# EAGLE design piZero_node (EAGLE 7.6.0)
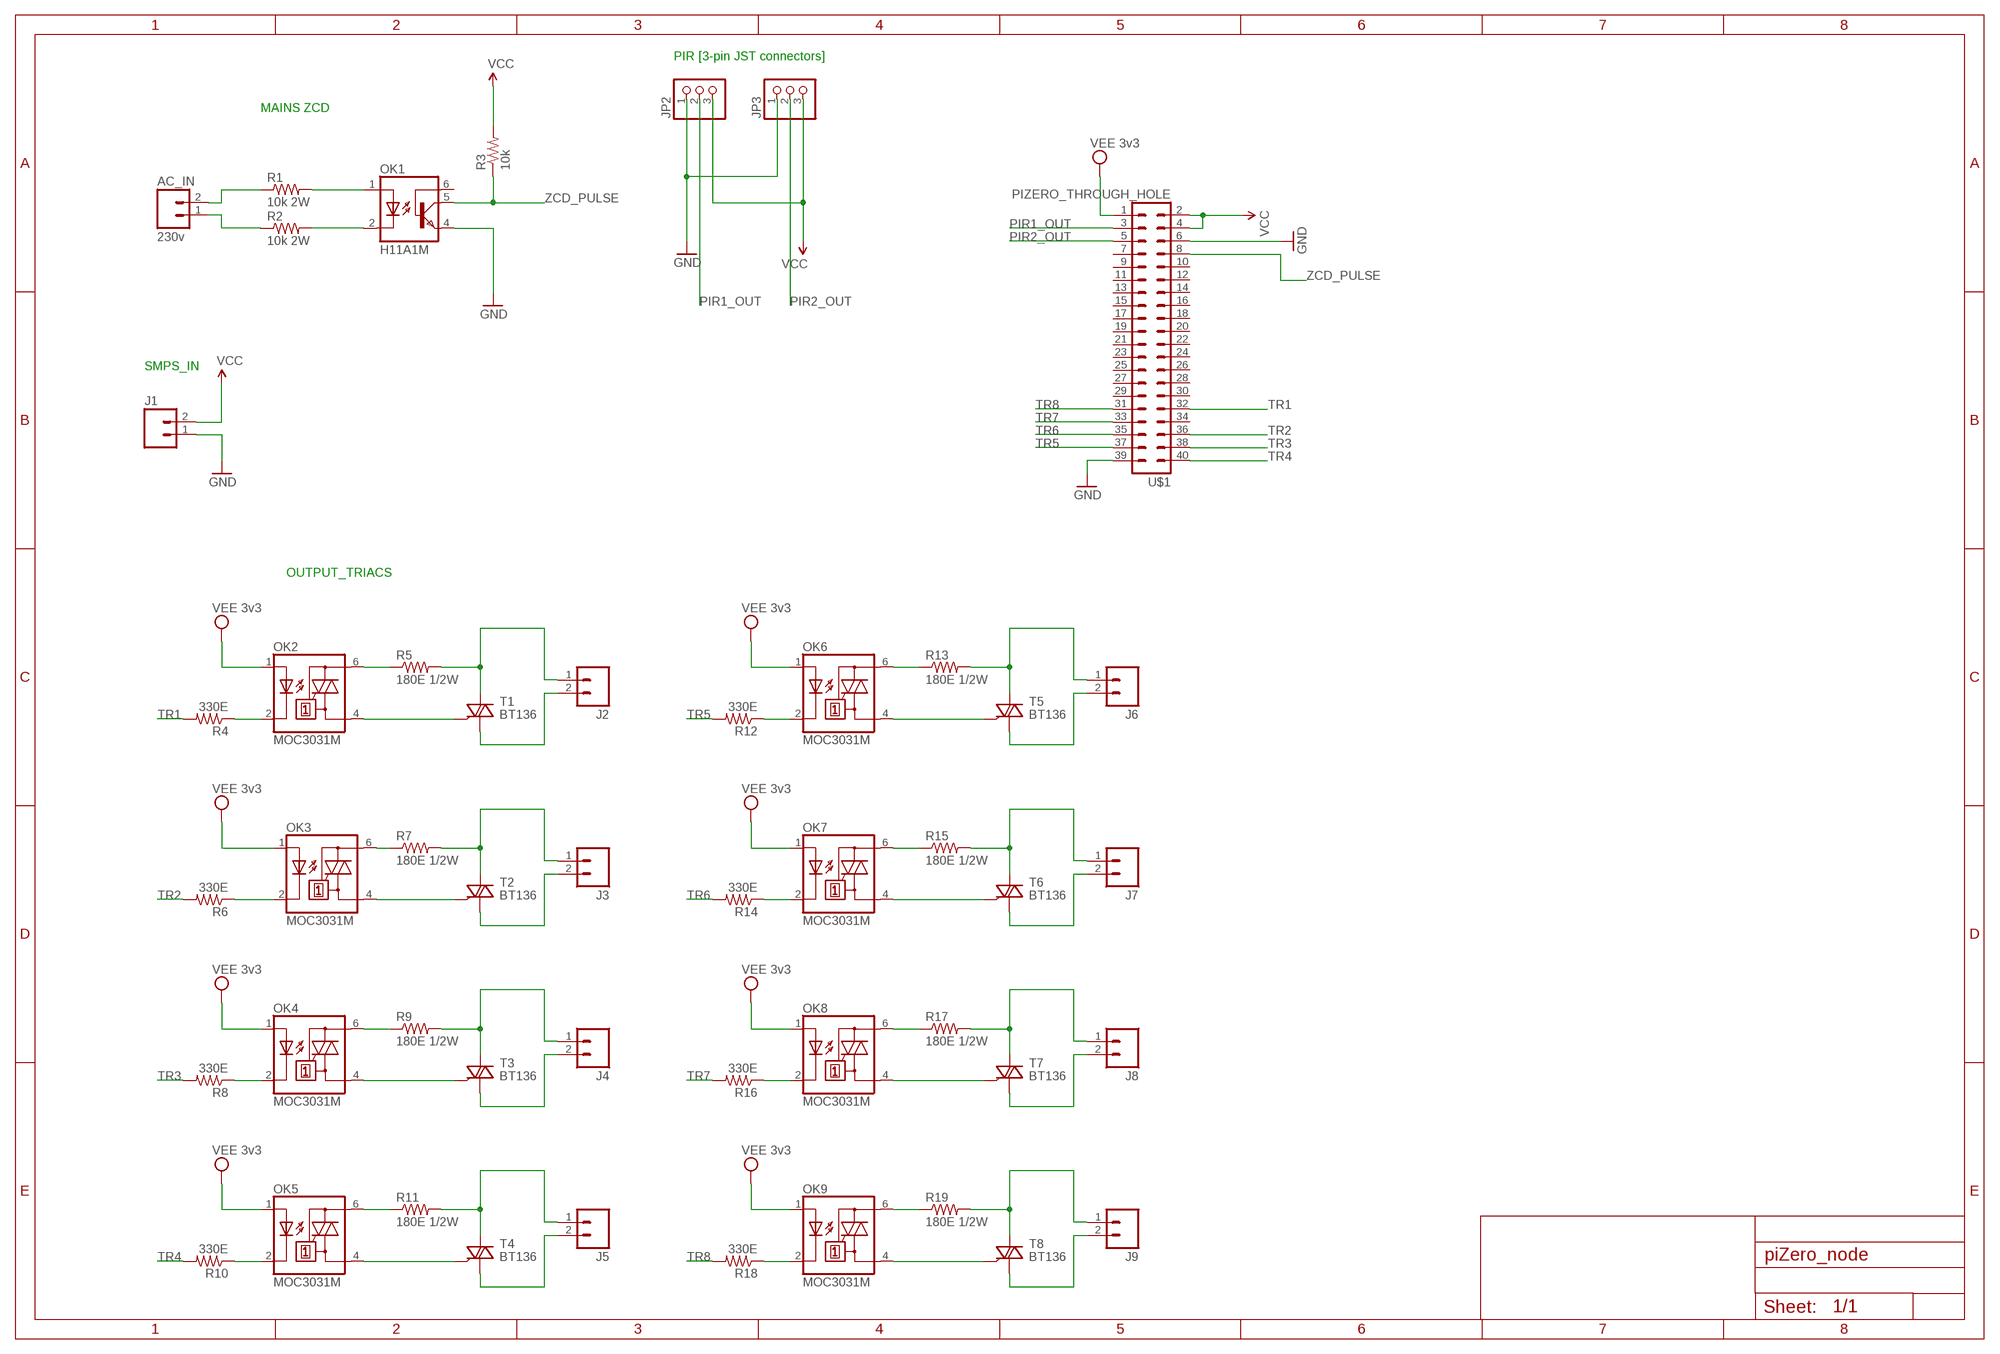
[diagram p0: schematic, sheet 1]

## Parts
AC_IN  230v  M023.5MM_LOCK  [SCREWTERMINAL-3.5MM-2_LOCK]
J1  M023.5MM_LOCK  [SCREWTERMINAL-3.5MM-2_LOCK]
J2  M023.5MM_LOCK  [SCREWTERMINAL-3.5MM-2_LOCK]
J3  M023.5MM_LOCK  [SCREWTERMINAL-3.5MM-2_LOCK]
J4  M023.5MM_LOCK  [SCREWTERMINAL-3.5MM-2_LOCK]
J5  M023.5MM_LOCK  [SCREWTERMINAL-3.5MM-2_LOCK]
J6  M023.5MM_LOCK  [SCREWTERMINAL-3.5MM-2_LOCK]
J7  M023.5MM_LOCK  [SCREWTERMINAL-3.5MM-2_LOCK]
J8  M023.5MM_LOCK  [SCREWTERMINAL-3.5MM-2_LOCK]
J9  M023.5MM_LOCK  [SCREWTERMINAL-3.5MM-2_LOCK]
JP2  PINHD-1X3  [1X03]
JP3  PINHD-1X3  [1X03]
OK1  H11A1M  [DIL06]
OK2  MOC3031M  [DIL06]
OK3  MOC3031M  [DIL06]
OK4  MOC3031M  [DIL06]
OK5  MOC3031M  [DIL06]
OK6  MOC3031M  [DIL06]
OK7  MOC3031M  [DIL06]
OK8  MOC3031M  [DIL06]
OK9  MOC3031M  [DIL06]
R1  10k 2W  RESISTORPTH-2W  [AXIAL-0.8]
R2  10k 2W  RESISTORPTH-2W  [AXIAL-0.8]
R3  10k  RESISTORPTH-1/4W  [AXIAL-0.4]
R4  330E  RESISTORPTH-1/4W  [AXIAL-0.4]
R5  180E 1/2W  RESISTORPTH-1/2W  [AXIAL-0.5]
R6  330E  RESISTORPTH-1/4W  [AXIAL-0.4]
R7  180E 1/2W  RESISTORPTH-1/2W  [AXIAL-0.5]
R8  330E  RESISTORPTH-1/4W  [AXIAL-0.4]
R9  180E 1/2W  RESISTORPTH-1/2W  [AXIAL-0.5]
R10  330E  RESISTORPTH-1/4W  [AXIAL-0.4]
R11  180E 1/2W  RESISTORPTH-1/2W  [AXIAL-0.5]
R12  330E  RESISTORPTH-1/4W  [AXIAL-0.4]
R13  180E 1/2W  RESISTORPTH-1/2W  [AXIAL-0.5]
R14  330E  RESISTORPTH-1/4W  [AXIAL-0.4]
R15  180E 1/2W  RESISTORPTH-1/2W  [AXIAL-0.5]
R16  330E  RESISTORPTH-1/4W  [AXIAL-0.4]
R17  180E 1/2W  RESISTORPTH-1/2W  [AXIAL-0.5]
R18  330E  RESISTORPTH-1/4W  [AXIAL-0.4]
R19  180E 1/2W  RESISTORPTH-1/2W  [AXIAL-0.5]
T1  BT136  [TO220AB]
T2  BT136  [TO220AB]
T3  BT136  [TO220AB]
T4  BT136  [TO220AB]
T5  BT136  [TO220AB]
T6  BT136  [TO220AB]
T7  BT136  [TO220AB]
T8  BT136  [TO220AB]
U$1  PIZERO_THROUGH_HOLE  [PIZERO_THOUGH_HOLE]

## Nets
GND: J1.1 JP2.1 JP3.1 OK1.4(EMI) U$1.6 U$1.39
N$1: AC_IN.2 R1.P$1
N$2: AC_IN.1 R2.P$1
N$3: OK1.1(A) R1.P$2
N$4: OK1.2(C) R2.P$2
N$5: OK3.6(A2) R7.P$1
N$6: OK2.6(A2) R5.P$1
N$7: J2.1 R5.P$2 T1.2(A2)
N$8: OK2.4(A1) T1.3(G)
N$9: J2.2 T1.1(A1)
N$10: OK2.2(C) R4.P$1
N$11: J3.1 R7.P$2 T2.2(A2)
N$12: OK3.4(A1) T2.3(G)
N$13: J3.2 T2.1(A1)
N$14: OK3.2(C) R6.P$1
N$15: OK4.6(A2) R9.P$1
N$16: J4.1 R9.P$2 T3.2(A2)
N$17: OK4.4(A1) T3.3(G)
N$18: J4.2 T3.1(A1)
N$19: OK4.2(C) R8.P$1
N$20: OK5.6(A2) R11.P$1
N$21: J5.1 R11.P$2 T4.2(A2)
N$22: OK5.4(A1) T4.3(G)
N$23: J5.2 T4.1(A1)
N$24: OK5.2(C) R10.P$1
N$25: OK6.6(A2) R13.P$1
N$26: J6.1 R13.P$2 T5.2(A2)
N$27: OK6.4(A1) T5.3(G)
N$28: J6.2 T5.1(A1)
N$29: OK6.2(C) R12.P$1
N$30: OK7.6(A2) R15.P$1
N$31: J7.1 R15.P$2 T6.2(A2)
N$32: OK7.4(A1) T6.3(G)
N$33: J7.2 T6.1(A1)
N$34: OK7.2(C) R14.P$1
N$35: OK8.6(A2) R17.P$1
N$36: J8.1 R17.P$2 T7.2(A2)
N$37: OK8.4(A1) T7.3(G)
N$38: J8.2 T7.1(A1)
N$39: OK8.2(C) R16.P$1
N$40: OK9.6(A2) R19.P$1
N$41: J9.1 R19.P$2 T8.2(A2)
N$42: OK9.4(A1) T8.3(G)
N$43: J9.2 T8.1(A1)
N$44: OK9.2(C) R18.P$1
PIR1_OUT: JP2.2 U$1.3
PIR2_OUT: JP3.2 U$1.5
TR1: R4.P$2 U$1.32
TR2: R6.P$2 U$1.36
TR3: R8.P$2 U$1.38
TR4: R10.P$2 U$1.40
TR5: R12.P$2 U$1.37
TR6: R14.P$2 U$1.35
TR7: R16.P$2 U$1.33
TR8: R18.P$2 U$1.31
VCC: J1.2 JP2.3 JP3.3 R3.P$2 U$1.2 U$1.4
VEE: OK2.1(A) OK3.1(A) OK4.1(A) OK5.1(A) OK6.1(A) OK7.1(A) OK8.1(A) OK9.1(A) U$1.1 ; supply symbol labelled VEE 3v3
ZCD_PULSE: OK1.5(COL) R3.P$1 U$1.8
Unconnected: OK1.6(BAS) U$1.7 U$1.9 U$1.10 U$1.11 U$1.12 U$1.13 U$1.14 U$1.15 U$1.16 U$1.17 U$1.18 U$1.19 U$1.20 U$1.21 U$1.22 U$1.23 U$1.24 U$1.25 U$1.26 U$1.27 U$1.28 U$1.29 U$1.30 U$1.34

## Notes on the sheet
- PIR [3-pin JST connectors]
- MAINS ZCD
- SMPS_IN
- OUTPUT_TRIACS

## Library data of the parts
AC_IN J1-J9 = SparkFun-Connectors:M02: Standard 2-pin 0.1" header. Use with - straight break away headers ( PRT-00116) - right angle break away headers (PRT-00553) - swiss pins (PRT-00743) - machine pins (PRT-00117) - female headers (PRT-00115) Molex polarized connector foot print use with: PRT-08233 with associated crimp pins and housings. 2.54_SCREWTERM for use with PRT-10571. 3.5mm Screw Terminal footprints for PRT-08084 5mm Screw Terminal footprints for use with PRT-08432; PROD_ID: CONN-08399
JP2 JP3 = pinhead:PINHD-1X3: PIN HEADER
OK1 = optocoupler:H11A*?M: General Purpose 6-Pin Phototransistor Optocouplers Source: http://www.fairchildsemi.com/ds/4N/4N35-M.pdf; MPN: H11A1-M; OC_FARNELL: 1021358; OC_NEWARK: 97K1793
OK2-OK9 = optocoupler:MOC30*: 6-Pin DIP Zero-Cross Optoisolators Triac Driver Output (250/400 Volt Peak) Source: Data sheet <http://www.fairchildsemi.com/ds/MO/MOC3031M.pdf> The old path of data sheet not more available 2013-05-06.; MF: FAIRCHILD SEMICONDUCTOR; MPN: MOC3031M; OC_FARNELL: 9875964; OC_NEWARK: 78K6089
R1-R19 = SparkFun-Passives:RESISTOR: Resistor Basic schematic elements and footprints for 0603, 1206, and PTH resistors.
T1-T8 = triac:BT136: Triac BT136 series E sensitive gate Source: http://www.nxp.com/acrobat_download/datasheets/BT136_SERIES_E_2.pdf
U$1 = pizero:PIZERO_THROUGH_HOLE

## Board
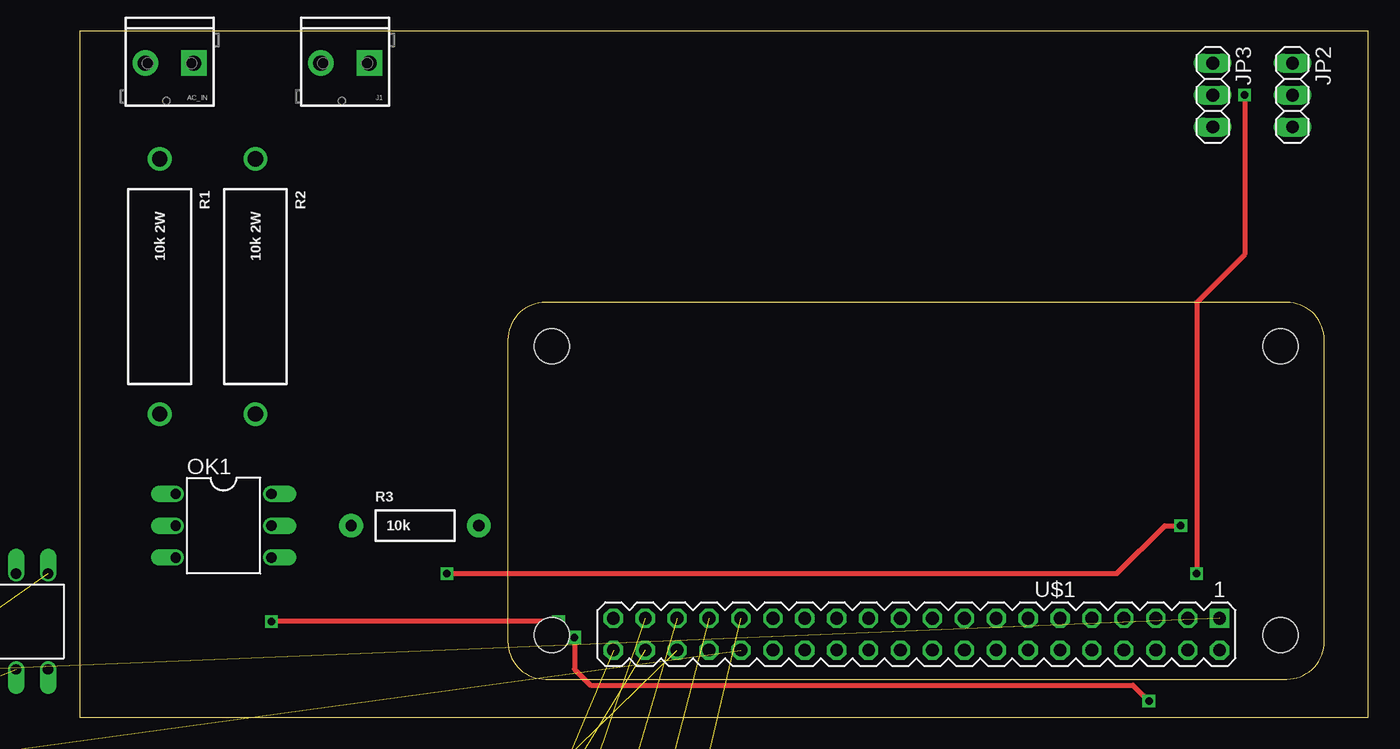
[diagram p1: board, top side]
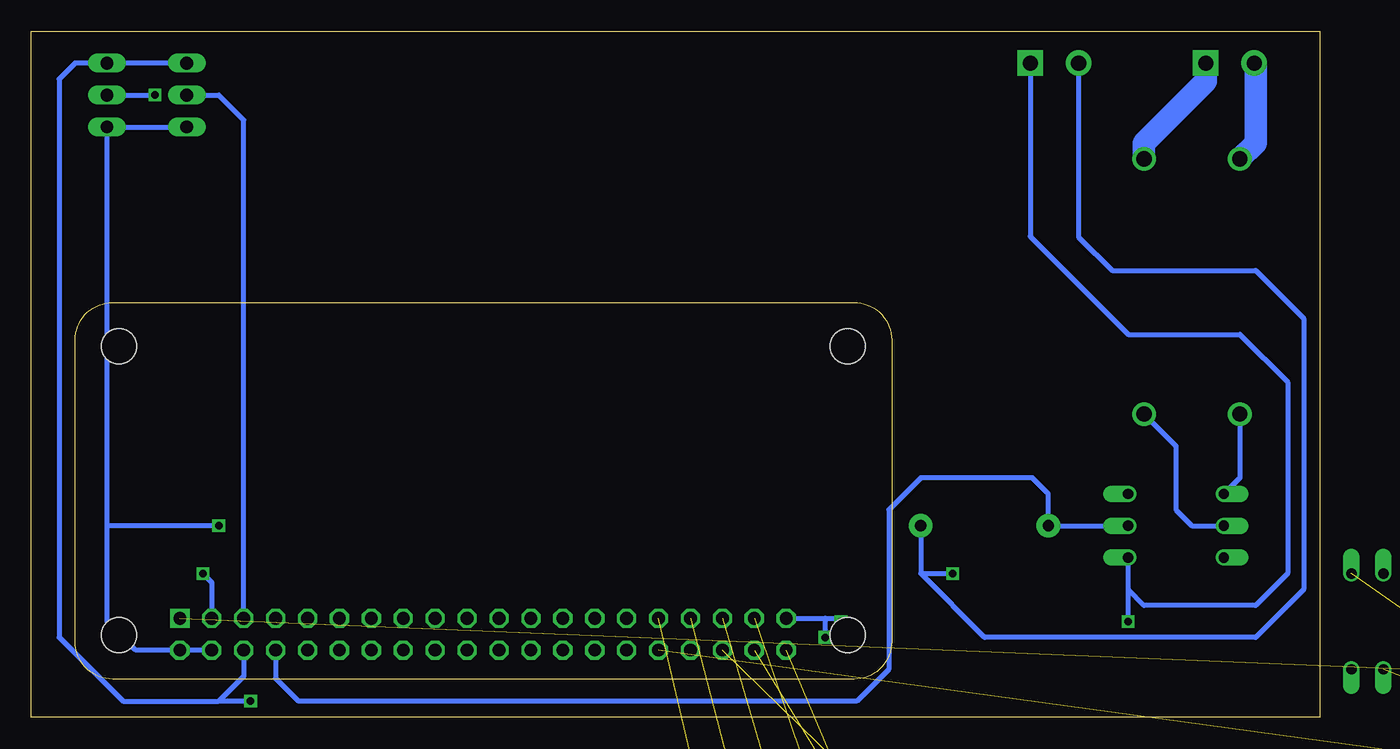
[diagram p2: board, bottom side, seen from below]

Size 102.54 x 54.6 mm. Coordinates in mm from the lower left corner, seen from the top.
Outline: 0,0 102.54,0 102.54,54.6 0,54.6 0,0
Copper layers (1*16): Top 0.035mm / dielectric 1.5mm / Bottom 0.035mm
Design rules "default": minimum track width 10mil, minimum drill 24mil, track to track 8mil, track to pad 8mil, pad to pad 8mil, via to via 8mil, smd to smd 8mil, copper to edge 40mil, drill to drill 8mil, minimum pad ring 10mil, minimum via ring 8mil, stop-mask expansion 4mil, vias tented up to drill 0mil, thermal gap 10mil

### Footprints (pad centres in the part's own frame; a part is rotated, then mirrored left to right if it is on the bottom)
SCREWTERMINAL-3.5MM-2_LOCK = drill 1.2 pad 2.032 square: 1 -0.178,0 | drill 1.2 pad 2.032: 2 3.678,0
1X03 = drill 1.016 long: 1 -2.54,0; 2 0,0; 3 2.54,0
DIL06 = drill 0.813 offset: 1 -2.54,-3.81; 2 0,-3.81; 3 2.54,-3.81; 4 2.54,3.81; 5 0,3.81; 6 -2.54,3.81
AXIAL-0.8 = drill 1.2 pad 1.88: P$1 -10.16,0; P$2 10.16,0
AXIAL-0.4 = drill 0.9 pad 1.88: P$1 -5.08,0; P$2 5.08,0
AXIAL-0.5 = drill 0.9 pad 1.88: P$1 -6.35,0; P$2 6.35,0
TO220AB = drill 1.118 long: 1 -2.54,-6.35; 2 0,-6.35; 3 2.54,-6.35 | hole 3.302: 0,11.176
PIZERO_THOUGH_HOLE = drill 1.016 square: 1 8.34,25.15 | drill 1.016 octagon: 2 8.34,27.69; 3 10.88,25.15; 4 10.88,27.69; 5 13.42,25.15; 6 13.42,27.69; 7 15.96,25.15; 8 15.96,27.69; 9 18.5,25.15; 10 18.5,27.69; 11 21.04,25.15; 12 21.04,27.69; 13 23.58,25.15; 14 23.58,27.69; 15 26.12,25.15; 16 26.12,27.69; 17 28.66,25.15; 18 28.66,27.69; 19 31.2,25.15; 20 31.2,27.69; 21 33.74,25.15; 22 33.74,27.69; 23 36.28,25.15; 24 36.28,27.69; 25 38.82,25.15; 26 38.82,27.69; 27 41.36,25.15; 28 41.36,27.69; 29 43.9,25.15; 30 43.9,27.69; 31 46.44,25.15; 32 46.44,27.69; 33 48.98,25.15; 34 48.98,27.69; 35 51.52,25.15; 36 51.52,27.69; 37 54.06,25.15; 38 54.06,27.69; 39 56.6,25.15; 40 56.6,27.69 | hole 2.8: 3.5,3.5; 3.5,26.5; 61.5,26.5; 61.5,3.5

### Placement (x,y rotation side)
AC_IN  8.89,52.07 180 top
J1  22.86,52.07 180 top
J2  -22.86,-15.24 0 top  (outside the outline)
J3  -22.86,-46.99 0 top  (outside the outline)
J4  -22.86,-83.82 0 top  (outside the outline)
J5  -22.86,-120.65 0 top  (outside the outline)
J6  -22.86,-157.48 0 top  (outside the outline)
J7  -22.86,-194.31 0 top  (outside the outline)
J8  -22.86,-231.14 0 top  (outside the outline)
J9  -22.86,-267.97 0 top  (outside the outline)
JP2  96.52,49.53 270 top
JP3  90.17,49.53 270 top
OK1  11.43,15.24 270 top
OK2  -5.08,7.62 0 top
OK3  -6.35,-26.67 0 top  (outside the outline)
OK4  -6.35,-63.5 0 top  (outside the outline)
OK5  -6.35,-100.33 0 top  (outside the outline)
OK6  -6.35,-137.16 0 top  (outside the outline)
OK7  -6.35,-173.99 0 top  (outside the outline)
OK8  -6.35,-210.82 0 top  (outside the outline)
OK9  -6.35,-247.65 0 top  (outside the outline)
R1  6.35,34.29 270 top
R2  13.97,34.29 270 top
R3  26.67,15.24 0 top
R4  -19.05,-3.81 0 top  (outside the outline)
R5  -17.78,-8.89 0 top  (outside the outline)
R6  -19.05,-54.61 0 top  (outside the outline)
R7  -8.89,-46.99 0 top  (outside the outline)
R8  -19.05,-91.44 0 top  (outside the outline)
R9  -8.89,-83.82 0 top  (outside the outline)
R10  -19.05,-128.27 0 top  (outside the outline)
R11  -8.89,-120.65 0 top  (outside the outline)
R12  -19.05,-165.1 0 top  (outside the outline)
R13  -8.89,-157.48 0 top  (outside the outline)
R14  -19.05,-201.93 0 top  (outside the outline)
R15  -8.89,-194.31 0 top  (outside the outline)
R16  -19.05,-238.76 0 top  (outside the outline)
R17  -8.89,-231.14 0 top  (outside the outline)
R18  -19.05,-275.59 0 top  (outside the outline)
R19  -8.89,-267.97 0 top  (outside the outline)
T1  -17.78,8.89 0 top  (outside the outline)
T2  -17.78,-34.29 0 top  (outside the outline)
T3  -17.78,-71.12 0 top  (outside the outline)
T4  -17.78,-107.95 0 top  (outside the outline)
T5  -17.78,-144.78 0 top  (outside the outline)
T6  -17.78,-181.61 0 top  (outside the outline)
T7  -17.78,-218.44 0 top  (outside the outline)
T8  -17.78,-255.27 0 top  (outside the outline)
U$1  99.06,33.02 180 top

### Tracks (layer width: path | path; a pad name or v marks a point on that pad's centre or on a via)
GND  (via drill 0.6)
  Top 0.406: v38.1,7.62 v15.24,7.62 | v39.37,6.35 39.37,3.81 40.64,2.54 83.82,2.54 v85.09,1.27
  Bottom 0.406: J1.1 23.04,38.28 15.24,30.48 6.35,30.48 2.54,26.67 2.54,11.43 5.08,8.89 13.97,8.89 15.24,10.16 | 15.24,10.16 OK1.4 | 87.63,1.27 95.25,1.27 100.33,6.35 100.33,50.8 99.06,52.07 JP2.1 JP3.1 | U$1.6 85.64,3.26 87.63,1.27 | v38.1,7.62 38.1,7.87 U$1.39 39.37,7.87 v39.37,6.35 | v15.24,7.62 15.24,10.16 | v85.09,1.27 87.63,1.27
N$1
  Bottom 1.778: AC_IN.2 5.08,52.07 5.08,45.72 R1.P$1
N$2
  Bottom 1.778: AC_IN.1 9.07,50.62 13.97,45.72 R2.P$1
N$3
  Bottom 0.406: R1.P$2 6.35,19.05 OK1.1
N$4
  Bottom 0.406: R2.P$2 11.43,21.59 11.43,16.51 10.16,15.24 OK1.2
N$5  (1 unrouted)
N$6  (1 unrouted)
N$7  (2 unrouted)
N$8  (1 unrouted)
N$9  (1 unrouted)
N$10  (1 unrouted)
N$11  (2 unrouted)
N$12  (1 unrouted)
N$13  (1 unrouted)
N$14  (1 unrouted)
N$15  (1 unrouted)
N$16  (2 unrouted)
N$17  (1 unrouted)
N$18  (1 unrouted)
N$19  (1 unrouted)
N$20  (1 unrouted)
N$21  (2 unrouted)
N$22  (1 unrouted)
N$23  (1 unrouted)
N$24  (1 unrouted)
N$25  (1 unrouted)
N$26  (2 unrouted)
N$27  (1 unrouted)
N$28  (1 unrouted)
N$29  (1 unrouted)
N$30  (1 unrouted)
N$31  (2 unrouted)
N$32  (1 unrouted)
N$33  (1 unrouted)
N$34  (1 unrouted)
N$35  (1 unrouted)
N$36  (2 unrouted)
N$37  (1 unrouted)
N$38  (1 unrouted)
N$39  (1 unrouted)
N$40  (1 unrouted)
N$41  (2 unrouted)
N$42  (1 unrouted)
N$43  (1 unrouted)
N$44  (1 unrouted)
PIR1_OUT  (via drill 0.6)
  Top 0.406: v92.71,49.53 92.71,36.83 88.9,33.02 v88.9,11.43
  Bottom 0.406: JP2.2 v92.71,49.53 | v88.9,11.43 88.18,10.71 U$1.3
PIR2_OUT
  Bottom 0.406: JP3.2 87.63,49.53 85.64,47.54 U$1.5
TR1  (1 unrouted)
TR2  (1 unrouted)
TR3  (1 unrouted)
TR4  (1 unrouted)
TR5  (1 unrouted)
TR6  (1 unrouted)
TR7  (1 unrouted)
TR8  (1 unrouted)
VCC  (via drill 0.6)
  Top 0.406: v29.21,11.43 82.55,11.43 86.36,15.24 v87.63,15.24
  Bottom 0.406: J1.2 19.18,38.23 16.51,35.56 5.08,35.56 1.27,31.75 1.27,10.16 5.08,6.35 26.67,6.35 31.75,11.43 | R3.P$2 31.75,11.43 | U$1.4 U$1.2 94.23,5.33 96.52,7.62 96.52,15.24 | 96.52,15.24 JP2.3 JP3.3 | 31.75,11.43 v29.21,11.43 | v87.63,15.24 96.52,15.24
VEE  (8 unrouted)
ZCD_PULSE
  Bottom 0.406: OK1.5 R3.P$1 21.59,17.78 22.86,19.05 31.75,19.05 34.29,16.51 34.29,3.81 36.83,1.27 81.28,1.27 83.1,3.09 U$1.8